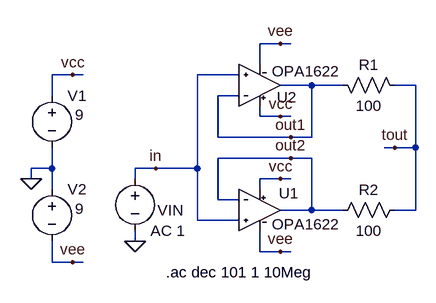
[diagram p0: schematic 18-opa1622_buffer.asc]
18-opa1622_buffer.asc, the LTspice schematic file:
Version 4
SHEET 1 880 680
WIRE -576 48 -608 48
WIRE -560 48 -576 48
WIRE -608 80 -608 48
WIRE -896 96 -928 96
WIRE -880 96 -896 96
WIRE -640 96 -704 96
WIRE -528 112 -576 112
WIRE -480 112 -528 112
WIRE -368 112 -400 112
WIRE -928 128 -928 96
WIRE -640 128 -672 128
WIRE -608 160 -608 144
WIRE -576 160 -608 160
WIRE -560 160 -576 160
WIRE -672 192 -672 128
WIRE -560 192 -672 192
WIRE -528 192 -528 112
WIRE -528 192 -560 192
WIRE -400 208 -416 208
WIRE -368 208 -368 112
WIRE -368 208 -400 208
WIRE -560 224 -672 224
WIRE -528 224 -560 224
WIRE -928 240 -928 208
WIRE -928 240 -960 240
WIRE -768 240 -800 240
WIRE -704 240 -704 96
WIRE -704 240 -768 240
WIRE -960 256 -960 240
WIRE -800 256 -800 240
WIRE -576 256 -608 256
WIRE -560 256 -576 256
WIRE -928 272 -928 240
WIRE -608 272 -608 256
WIRE -672 288 -672 224
WIRE -640 288 -672 288
WIRE -528 304 -528 224
WIRE -528 304 -576 304
WIRE -480 304 -528 304
WIRE -368 304 -368 208
WIRE -368 304 -400 304
WIRE -704 320 -704 240
WIRE -640 320 -704 320
WIRE -800 352 -800 336
WIRE -608 368 -608 336
WIRE -576 368 -608 368
WIRE -560 368 -576 368
WIRE -928 384 -928 352
WIRE -896 384 -928 384
WIRE -880 384 -896 384
FLAG -960 256 0
FLAG -896 96 vcc
FLAG -896 384 vee
FLAG -576 368 vee
FLAG -576 256 vcc
FLAG -800 352 0
FLAG -576 48 vee
FLAG -576 160 vcc
FLAG -768 240 in
FLAG -400 208 tout
FLAG -560 192 out1
FLAG -560 224 out2
SYMBOL voltage -928 112 R0
WINDOW 3 36 45 Left 2
SYMATTR Value 9
SYMATTR InstName V1
SYMBOL voltage -928 256 R0
WINDOW 3 36 46 Left 2
SYMATTR Value 9
SYMATTR InstName V2
SYMBOL res -384 288 R90
WINDOW 0 0 56 VBottom 2
WINDOW 3 32 56 VTop 2
SYMATTR InstName R2
SYMATTR Value 100
SYMBOL voltage -800 240 R0
WINDOW 0 35 64 Left 2
SYMATTR InstName VIN
SYMATTR Value AC 1
SYMBOL res -384 128 M270
WINDOW 0 32 56 VTop 2
WINDOW 3 0 56 VBottom 2
SYMATTR InstName R1
SYMATTR Value 100
SYMBOL OPA1622 -608 304 R0
WINDOW 0 45 -10 Bottom 2
WINDOW 3 71 6 Top 2
SYMATTR InstName U1
SYMBOL OPA1622 -608 112 M180
WINDOW 0 42 -3 Bottom 2
WINDOW 3 71 6 Top 2
SYMATTR InstName U2
TEXT -752 400 Left 2 !.ac dec 101 1 10Meg

The netlist it stands for:
* 18-opa1622_buffer.asc
V1 vcc 0 9
V2 0 vee 9
R2 tout out2 100
VIN in 0 AC 1
R1 tout out1 100
XU1 in out2 vcc vee out2 OPA1622  ; pins IN+ IN- VCC VEE OUT
XU2 in out1 vcc vee out1 OPA1622  ; pins IN+ IN- VCC VEE OUT
.ac dec 101 1 10Meg
.lib OPA1622.LIB
.backanno
.end

* Results of the author's LTspice run, read from the files saved beside the schematic
* Operating Point, zero values left out:
*   V(vcc) = 9 V
*   V(vee) = -9 V
*   V(tout) = 98.25 µV
*   V(out2) = 98.25 µV
*   V(out1) = 98.25 µV
*   I(V1) = -5.202 mA
*   I(V2) = -5.2 mA
*   I(Vin) = -2.4 µA
*   Ix(u1:IN+) = 1.2 µA
*   Ix(u1:IN-) = 1.19 µA
*   Ix(u1:VCC) = 2.601 mA
*   Ix(u1:VEE) = -2.6 mA
*   Ix(u1:OUT) = -1.19 µA
*   Ix(u2:IN+) = 1.2 µA
*   Ix(u2:IN-) = 1.19 µA
*   Ix(u2:VCC) = 2.601 mA
*   Ix(u2:VEE) = -2.6 mA
*   Ix(u2:OUT) = -1.19 µA
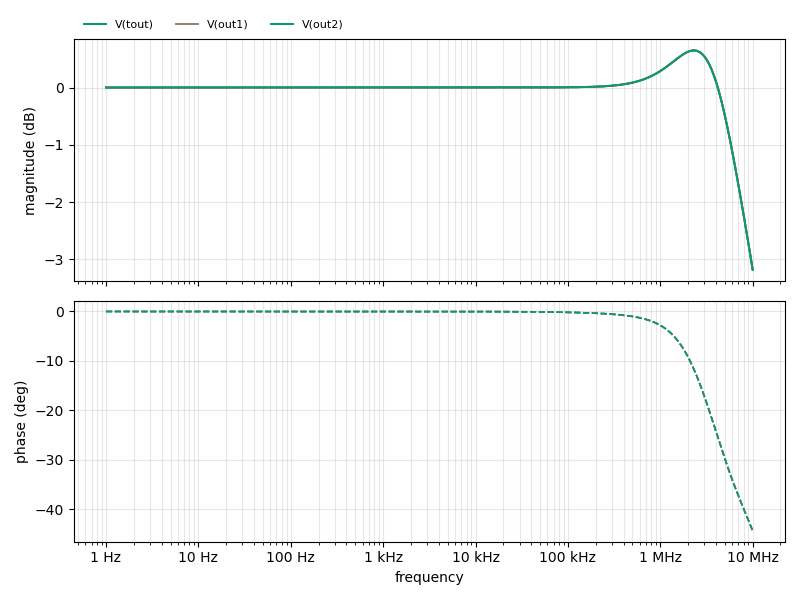
[diagram p1: AC Analysis of 18-opa1622_buffer.asc, plotted from the saved traces]
* AC Analysis, 1 run:
*   V(tout): -0.00 dB at 1 Hz, -3.18 dB at 10 MHz, peak 0.65 dB at 2.325 MHz, 3 dB below the peak at 8.254 MHz
*   V(out1): -0.00 dB at 1 Hz, -3.18 dB at 10 MHz, peak 0.65 dB at 2.325 MHz, 3 dB below the peak at 8.254 MHz
*   V(out2): -0.00 dB at 1 Hz, -3.18 dB at 10 MHz, peak 0.65 dB at 2.325 MHz, 3 dB below the peak at 8.254 MHz